# EAGLE design esp-01 board (EAGLE 7.3.0)
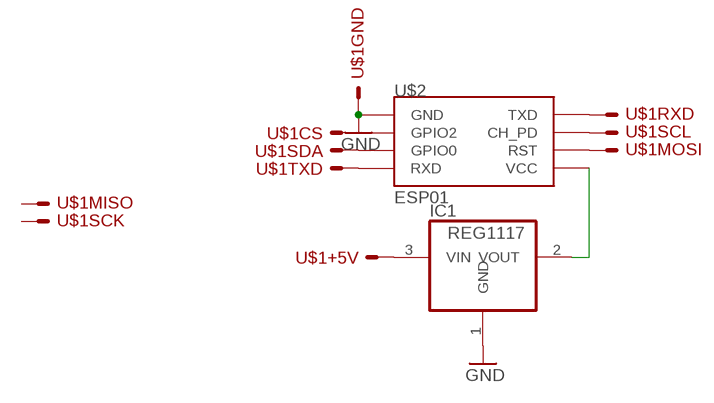
[diagram p0: schematic, sheet 1]

## Parts
IC1  REG1117  [SOT223]
U$1  SPI_BUS  [SPI_BUS]
U$2  ESP01  [ESP01]

## Nets
GND: IC1.1(GND) U$1.GND U$2.GND
N$1: U$1.RXD U$2.TX(TXD)
N$3: U$1.TXD U$2.RX(RXD)
N$4: U$1.CS U$2.GPIO2
N$5: U$1.SDA U$2.GPIO0
N$6: U$1.SCL U$2.CH_PD
N$7: U$1.MOSI U$2.RST
N$8: IC1.3(VIN) U$1.+5V
N$9: IC1.2(VOUT) U$2.VCC
Unconnected: U$1.MISO U$1.SCK

## Library data of the parts
IC1 = burr-brown:REG1117: 800mA and 1A Low Dropout (LDO) Positive Regulator 1.8V, 2.5V, 2.85V, 3.3V, 5V, and Adj; MPN: REG1117; OC_FARNELL: 1097566; OC_NEWARK: 14P6981
U$1 = lieven:SPI_BUS
U$2 = esp8266modules:ESP01: ESP8266 Wifi module 01

## Board
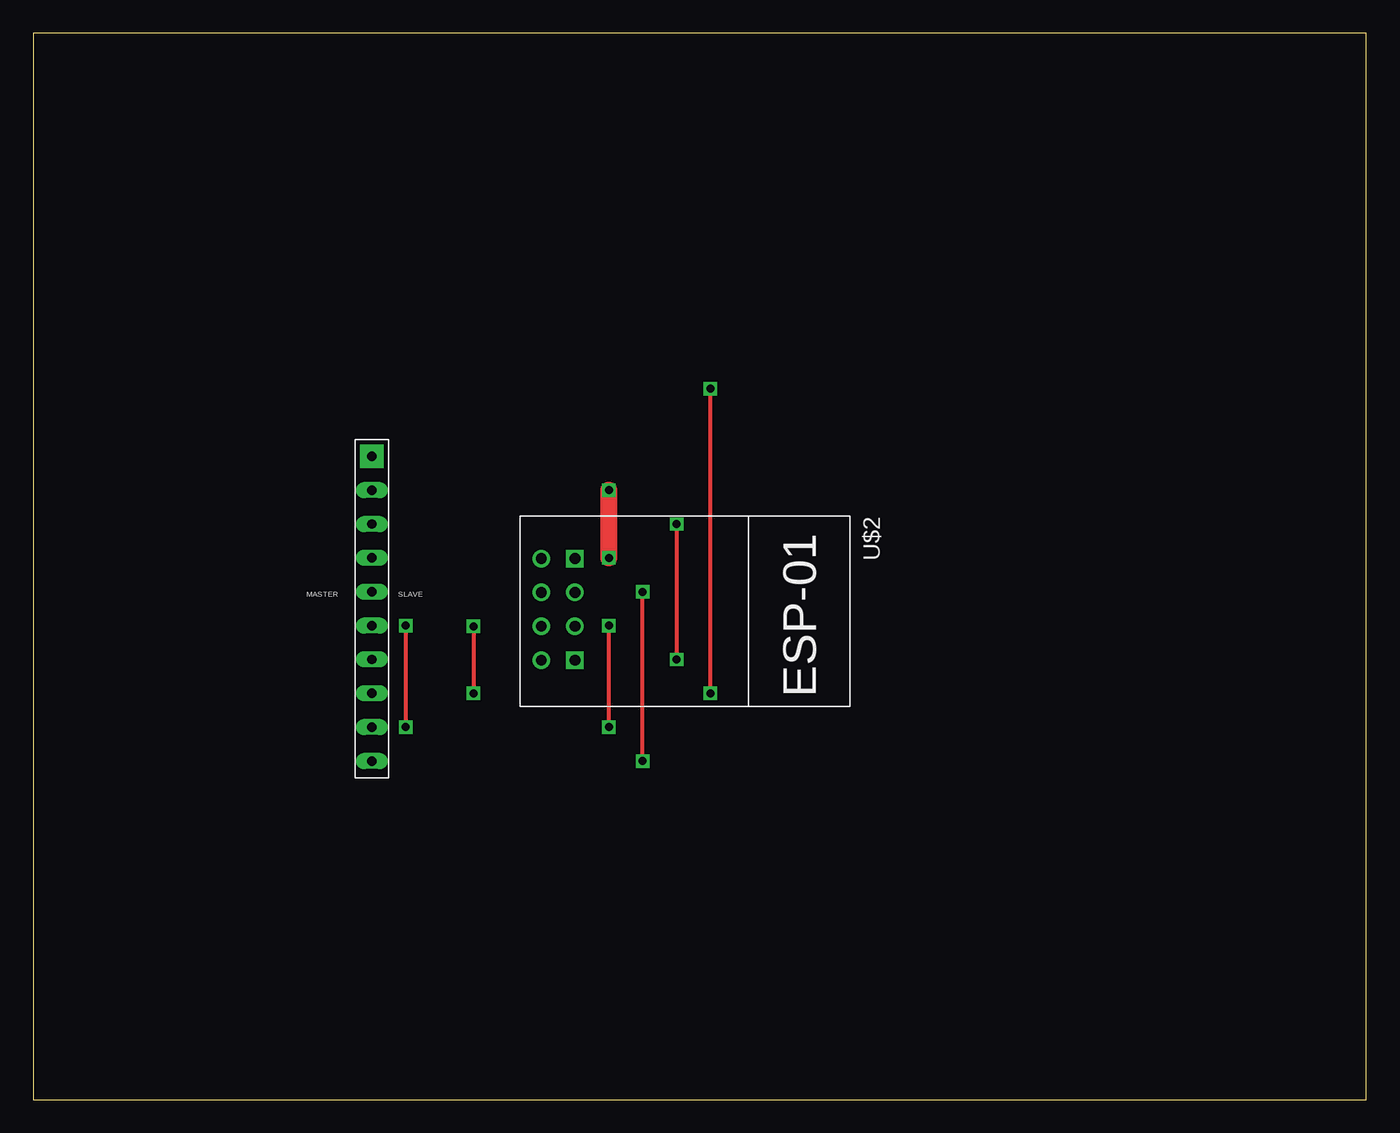
[diagram p1: board, top side]
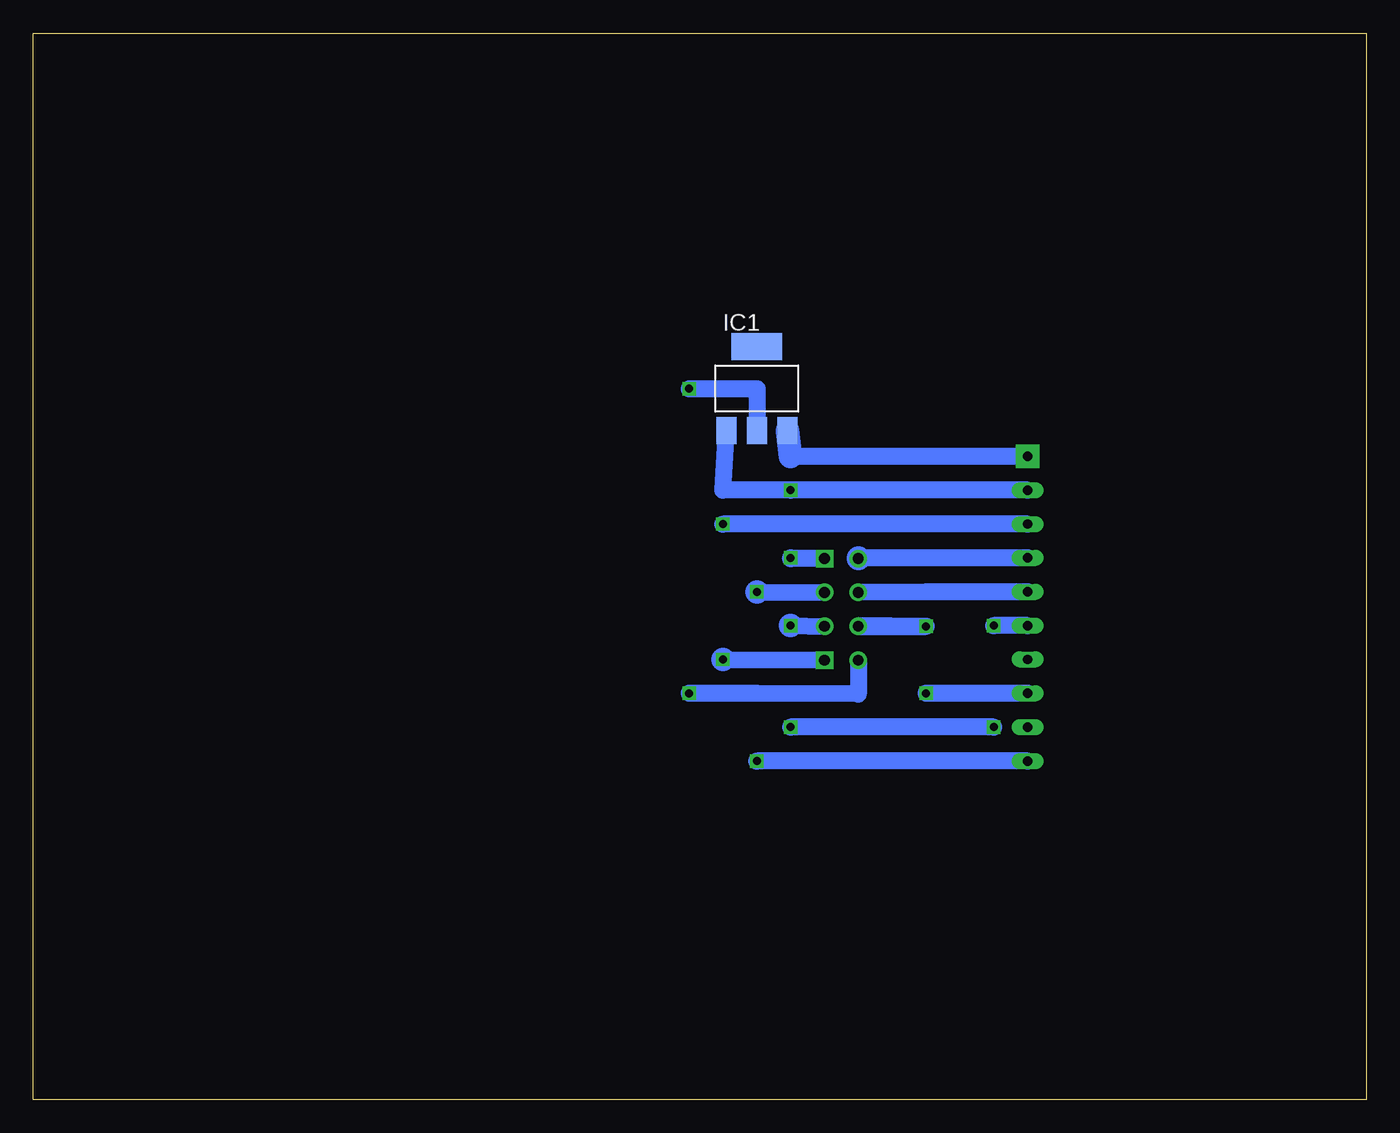
[diagram p2: board, bottom side, seen from below]

Size 100 x 80 mm. Coordinates in mm from the lower left corner, seen from the top.
Outline: 0,0 100,0 100,80 0,80 0,0
Copper layers (1*16): Top 0.035mm / dielectric 1.5mm / Bottom 0.035mm
Design rules "default": minimum track width 10mil, minimum drill 24mil, track to track 8mil, track to pad 8mil, pad to pad 8mil, via to via 8mil, smd to smd 8mil, copper to edge 40mil, drill to drill 8mil, minimum pad ring 10mil, minimum via ring 8mil, stop-mask expansion 4mil, vias tented up to drill 0mil, thermal gap 10mil

### Footprints (pad centres in the part's own frame; a part is rotated, then mirrored left to right if it is on the bottom)
SOT223 = smd 1.499 x 2.007: 1 -2.261,-3.15; 2 0.025,-3.15; 3 2.311,-3.15 | smd 3.81 x 2.007: 4 0,3.15
SPI_BUS = drill 0.7 pad 1.778 square: +5V 0,0 | drill 0.7 long: CS 0,22.86; GND 0,2.54; MISO 0,15.24; MOSI 0,17.78; RXD 0,7.62; SCK 0,20.32; SCL 0,10.16; SDA 0,12.7; TXD 0,5.08
ESP01 = drill 0.8: CH_PD 2.59,0.001; GPIO0 5.13,2.541; GPIO2 2.59,2.541; RST 5.13,0.001; TX 0.05,0.001; VCC 7.67,0.001 | drill 0.8 square: GND 0.05,2.541; RX 7.67,2.541

### Placement (x,y rotation side)
IC1  45.72,53.34 0 bottom
U$1  25.4,48.26 180 top
U$2  38.1,40.64 270 top

### Tracks (layer width: path | path; a pad name or v marks a point on that pad's centre or on a via)
GND  (via drill 0.6)
  Top 1.27: v43.18,40.64 v43.18,45.72
  Bottom 1.27: U$1.GND v43.18,45.72 48.26,45.72 IC1.1 | U$2.GND 43.18,40.59 v43.18,40.64
N$1
  Bottom 1.27: U$1.RXD 38.1,40.64
  Bottom 1.778: 38.1,40.64 U$2.TX
N$3  (via drill 0.6)
  Top 0.305: v48.26,43.18 v48.26,33.02
  Bottom 1.27: U$1.TXD v48.26,43.18 | v48.26,33.02 U$2.RX
  Bottom 1.778: v48.26,33.02
N$4  (via drill 0.6)
  Top 0.305: v45.72,25.4 v45.72,38.1
  Bottom 1.27: U$1.CS v45.72,25.4 | v45.72,38.1 U$2.GPIO2
  Bottom 1.778: v45.72,38.1
N$5  (via drill 0.6)
  Top 0.305: v27.94,35.56 v27.94,27.94 | v43.18,27.94 v43.18,35.56
  Bottom 1.27: U$1.SDA v27.94,35.56 | v27.94,27.94 v43.18,27.94 | v43.18,35.56 U$2.GPIO0
  Bottom 1.778: v43.18,35.56
N$6
  Bottom 1.27: U$1.SCL 33.02,38.1 U$2.CH_PD
N$7  (via drill 0.6)
  Top 0.305: v33.02,35.51 v33.02,30.48
  Bottom 1.27: U$2.RST v33.02,35.51 38.1,35.56 | U$1.MOSI v33.02,30.48
N$8
  Bottom 1.27: U$1.+5V 43.18,48.26
  Bottom 1.778: 43.18,48.26 IC1.3
N$9  (via drill 0.6)
  Top 0.305: v50.8,30.48 v50.8,53.34
  Bottom 1.27: U$2.VCC 38.1,30.43 45.72,30.48 v50.8,30.48 | v50.8,53.34 45.7,53.34 IC1.2